# EAGLE design inwich (EAGLE 9.5.2)
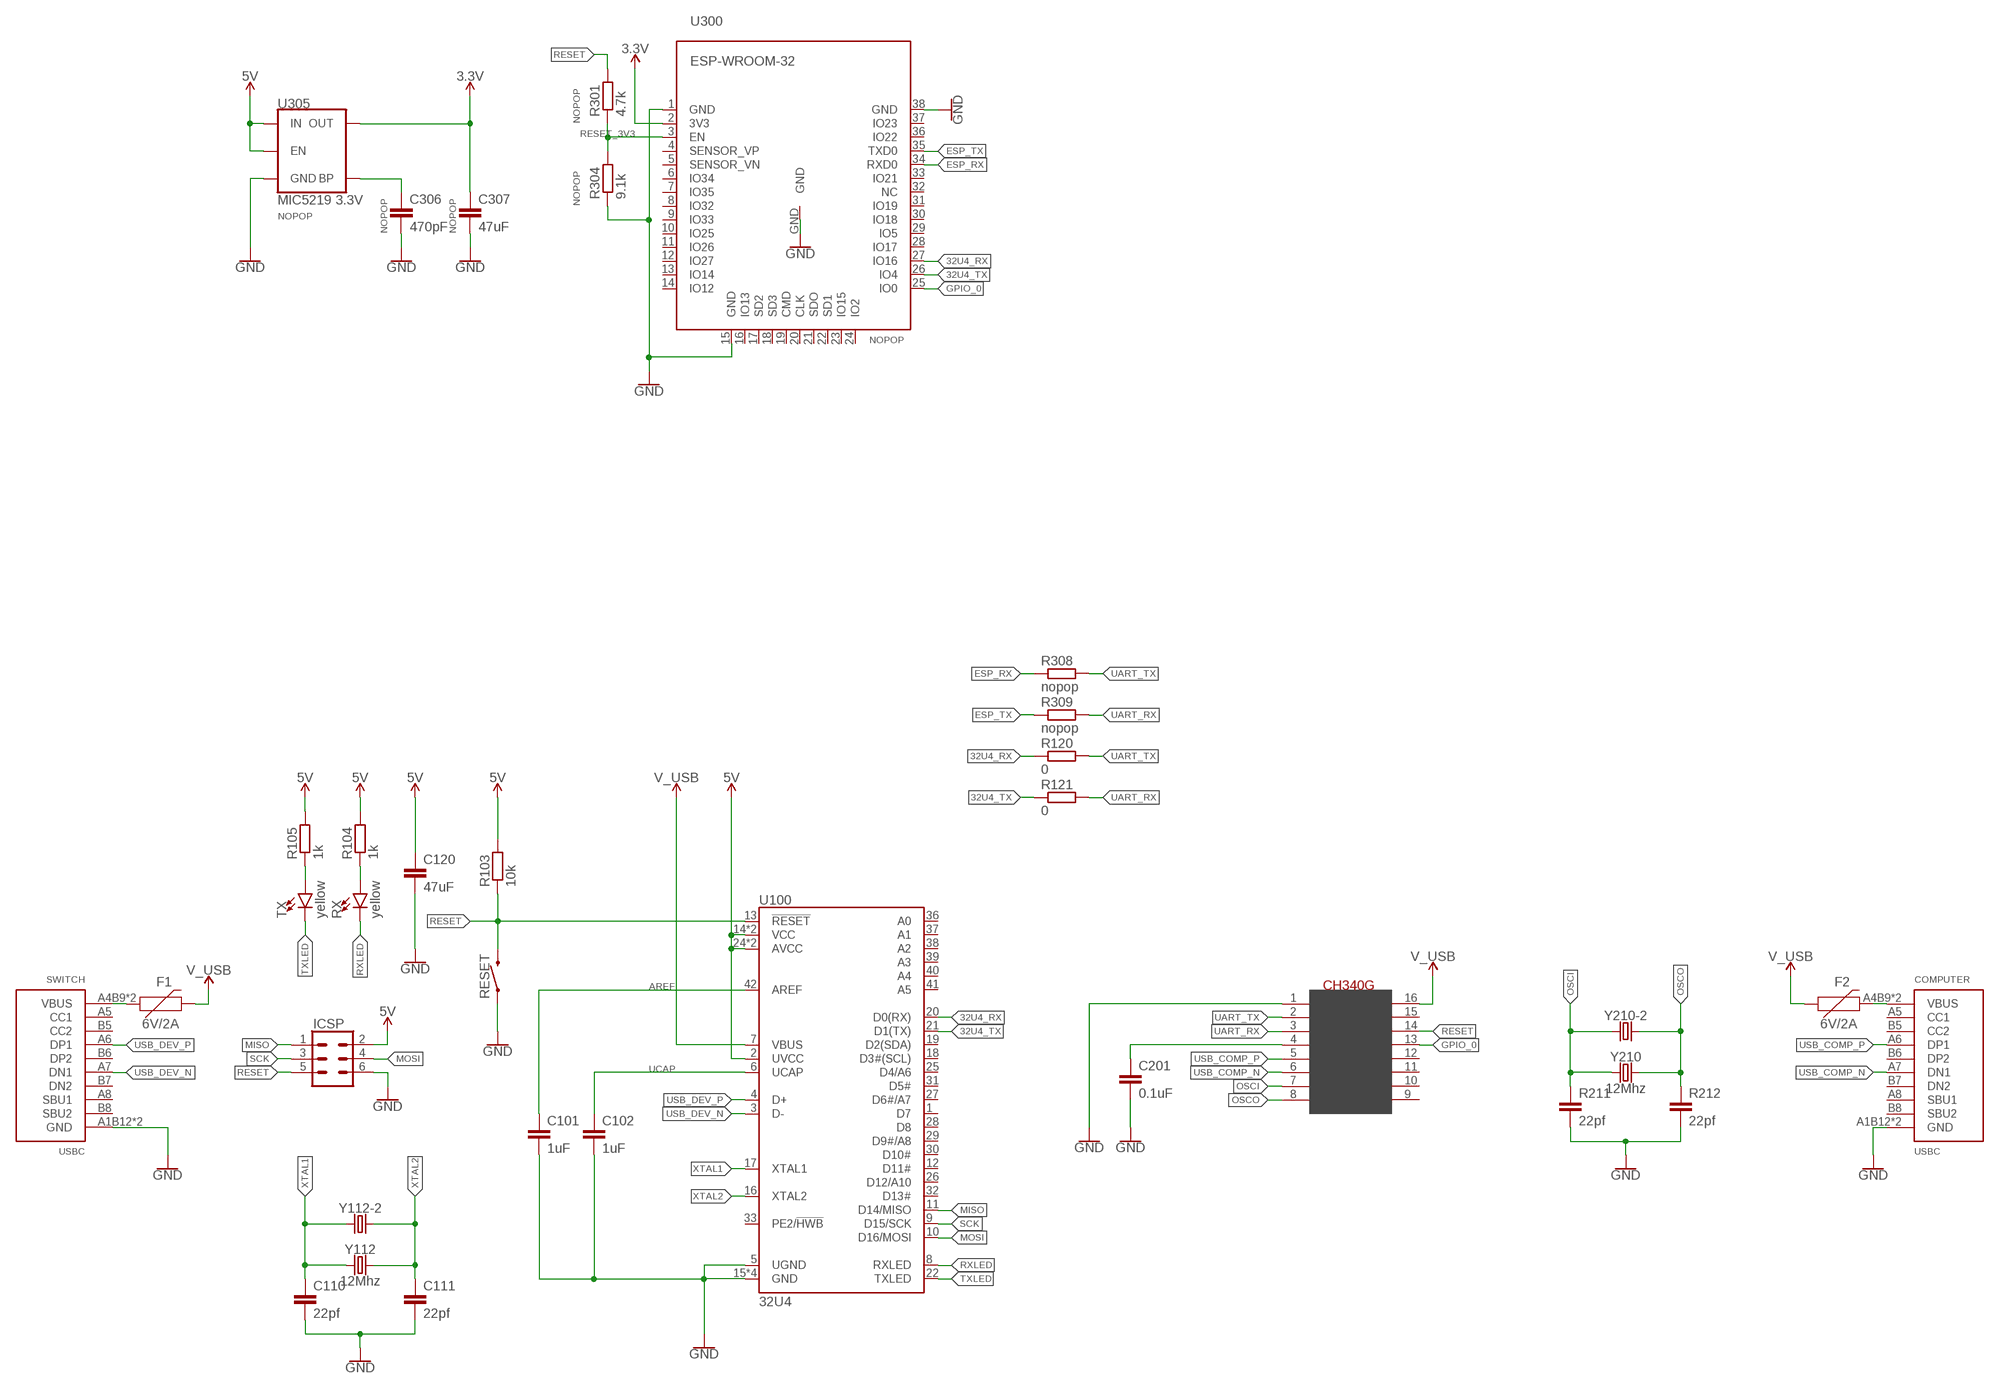
[diagram p0: schematic, sheet 1]

## Parts
C101  1uF  C-EUC0805  [C0805]
C102  1uF  C-EUC0805  [C0805]
C110  22pf  C-EUC0805  [C0805]
C111  22pf  C-EUC0805  [C0805]
C120  47uF  C-EUC0805  [C0805]
C201  0.1uF  C-EUC0805  [C0805]
C306  470pF  C-EUC0805  [C0805]
C307  47uF  C-EUC0805  [C0805]
COMPUTER  USBC  [USBC]
F1  6V/2A  PPTC_6V2A  [1210]
F2  6V/2A  PPTC_6V2A  [1210]
ICSP  CONN_03X2SHROUD  [2X3-SHROUDED]
R103  10k  R-EU_R0805  [R0805]
R104  1k  R-EU_R0805  [R0805]
R105  1k  R-EU_R0805  [R0805]
R120  0  R-EU_R0805  [R0805]
R121  0  R-EU_R0805  [R0805]
R211  22pf  C-EUC0805  [C0805]
R212  22pf  C-EUC0805  [C0805]
R301  4.7k  R-EU_R0805  [R0805]
R304  9.1k  R-EU_R0805  [R0805]
R308  nopop  R-EU_R0805  [R0805]
R309  nopop  R-EU_R0805  [R0805]
RESET  MOMENTARY-SWITCH-SPST-SMD-6.0X3.5MM  [TACTILE_SWITCH_SMD_6.0X3.5MM]
RX  yellow  LED1206  [LED-1206]
SWITCH  USBC  [USBC]
TX  yellow  LED1206  [LED-1206]
U100  32U4  ATMEGA32U4-ARDUINOTQFP-44  [TQFP44]
U200  CH340G  [SOIC16]
U300  ESP-WROOM-32  [ESP-WROOM-32]
U305  MIC5219 3.3V  V_REG_MIC52193.3V  [SOT23-5]
Y112  12Mhz  CRYSTALSMD-HC49UP  [HC49UP]
Y112-2  CRYSTALPTH-HC49UV  [HC49U]
Y210  12Mhz  CRYSTALSMD-HC49UP  [HC49UP]
Y210-2  CRYSTALPTH-HC49UV  [HC49U]

## Nets
3.3V: C307.1 U300.2(3V3) U305.5(OUT)
5V: C120.1 ICSP.2 R103.2 R104.2 R105.2 U100.2(UVCC) U100.14(VCC) U100.24(AVCC) U100.34(VCC) U100.44(AVCC) U305.1(IN) U305.3(EN)
32U4_RX: R120.1 U100.20(D0(RX)) U300.27(IO16)
32U4_TX: R121.1 U100.21(D1(TX)) U300.26(IO4)
AREF: C101.1 U100.42(AREF)
ESP_RX: R308.1 U300.34(RXD0)
ESP_TX: R309.1 U300.35(TXD0)
GND: C101.2 C102.2 C110.2 C111.2 C120.2 C201.2 C306.2 C307.2 COMPUTER.A1B12(GND) COMPUTER.B1A12(GND) ICSP.6 R211.2 R212.2 R304.1 RESET.1 SWITCH.A1B12(GND) SWITCH.B1A12(GND) U100.5(UGND) U100.15(GND) U100.23(GND) U100.35(GND) U100.43(GND) U200.1(GND) U300.1(GND) U300.15(GND) U300.38(GND) U300.GND U305.2(GND)
GPIO_0: U200.13(DTR) U300.25(IO0)
MISO: ICSP.1 U100.11(D14/MISO)
MOSI: ICSP.4 U100.10(D16/MOSI)
N$1: R105.1 TX.A
N$3: R104.1 RX.A
N$8: C201.1 U200.4(V3)
N$12: C306.1 U305.4(BP)
OSCI: R211.1 U200.7(XI) Y210-2.1 Y210.1
OSCO: R212.1 U200.8(XO) Y210-2.2 Y210.2
RESET: ICSP.5 R103.1 R301.2 RESET.2 U100.13(!RESET) U200.14(RTS)
RESET_3V3: R301.1 R304.2 U300.3(EN)
RXLED: RX.C U100.8(RXLED)
SCK: ICSP.3 U100.9(D15/SCK)
TXLED: TX.C U100.22(TXLED)
UART_RX: R121.2 R309.2 U200.3(RX)
UART_TX: R120.2 R308.2 U200.2(TX)
UCAP: C102.1 U100.6(UCAP)
USB_COMP_N: COMPUTER.A7(DN1) U200.6(D-)
USB_COMP_P: COMPUTER.A6(DP1) U200.5(D+)
USB_DEV_N: SWITCH.A7(DN1) U100.3(D-)
USB_DEV_P: SWITCH.A6(DP1) U100.4(D+)
V_USB: F1.2 F2.1 U100.7(VBUS) U200.16(VCC)
V_USB_DEV: F1.1 SWITCH.A4B9(VBUS) SWITCH.B4A9(VBUS)
VUSB_COMP: COMPUTER.A4B9(VBUS) COMPUTER.B4A9(VBUS) F2.2
XTAL1: C110.1 U100.17(XTAL1) Y112-2.1 Y112.1
XTAL2: C111.1 U100.16(XTAL2) Y112-2.2 Y112.2
Unconnected: COMPUTER.A5(CC1) COMPUTER.A8(SBU1) COMPUTER.B5(CC2) COMPUTER.B6(DP2) COMPUTER.B7(DN2) COMPUTER.B8(SBU2) SWITCH.A5(CC1) SWITCH.A8(SBU1) SWITCH.B5(CC2) SWITCH.B6(DP2) SWITCH.B7(DN2) SWITCH.B8(SBU2) U100.1(D7) U100.12(D11#) U100.18(D3#(SCL)) U100.19(D2(SDA)) U100.25(D4/A6) U100.26(D12/A10) U100.27(D6#/A7) U100.28(D8) U100.29(D9#/A8) U100.30(D10#) U100.31(D5#) U100.32(D13#) U100.33(PE2/!HWB) U100.36(A0) U100.37(A1) U100.38(A2) U100.39(A3) U100.40(A4) U100.41(A5) U200.9(CTS) U200.10(DSR) U200.11(RI) U200.12(DCD) U200.15(RS232) U300.4(SENSOR_VP) U300.5(SENSOR_VN) U300.6(IO34) U300.7(IO35) U300.8(IO32) U300.9(IO33) U300.10(IO25) U300.11(IO26) U300.12(IO27) U300.13(IO14) U300.14(IO12) U300.16(IO13) U300.17(SD2) U300.18(SD3) U300.19(CMD) U300.20(CLK) U300.21(SDO) U300.22(SD1) U300.23(IO15) U300.24(IO2) U300.28(IO17) U300.29(IO5) U300.30(IO18) U300.31(IO19) U300.32(NC) U300.33(IO21) U300.36(IO22) U300.37(IO23)

## Notes on the sheet
- NOPOP
- NOPOP
- NOPOP
- NOPOP | NOPOP
- NOPOP

## Library data of the parts
C101 C102 C110 C111 C120 C201 C306 C307 R211 R212 = rcl:C-EU: CAPACITOR, European symbol; SPICEPREFIX: C
COMPUTER SWITCH = geusebio:USBC
F1 F2 = SparkFun-Fuses:PPTC: Resettable Fuse PPTC Resettable Fuse. Really a sort of resistor with a polymeric positive temperature coefficient whose resistance increases dramatically with an increase in temperature. When heated by the power passing through the resistance rises causing the current to be limited, protecting the circuit. This is achieved by the transition of the polymer from a crystalline to an amorphous state where the conductive carbon separates breaking the conductive pathways found in the cool crystalline structure. When a PPTC cools back down it resumes conducting letting the circuit turn back on. SparkFun Products: SparkFun RedBoard - Programmed with Arduino <https://www.sparkfun.com/products/12757> Pro Micro - 5V/16MHz <https://www.sparkfun.com/products/12640> Arduino Pro 328 - 5V/16MHz <https://www.sparkfun.com/products/10915> MP3 Trigger <https://www.sparkfun.com/products/13720>; PROD_ID: RES-14313
ICSP = SparkFun-Connectors:CONN_03X2: Multi connection point. Often used as Generic Header-pin footprint for 0.1 inch spaced/style header connections You can populate with any combo of single row headers, but if you'd like an exact match, check these: Header - 2x3 (Male, 0.1") <https://www.sparkfun.com/products/12807> (PRT-12807) Header - 2x3 (Female, 0.1") <https://www.sparkfun.com/products/13010> (PRT-13010) 2x3 Pin Shrouded Header <https://www.sparkfun.com/products/10877> (PRT-10877) On any of the 0.1 inch spaced packages, you can populate with these: Break Away Headers - Straight <https://www.sparkfun.com/products/116> (PRT-00116) Break Away Male Headers - Right Angle <https://www.sparkfun.com/products/553> (PRT-00553) Female Headers <https://www.sparkfun.com/products/115> (PRT-00115) Break Away Headers - Machine Pin <https://www.sparkfun.com/products/117> (PRT-00117) Break Away Female Headers - Swiss Machine Pin <https://www.sparkfun.com/products/743> (PRT-00743) Special note: the shrouded connector mates well with our 3x2 ribbon cables: Ribbon Crimp Connector - 6-pin (2x3, Female) <https://www.sparkfun.com/products/10651> (PRT-10651) Ribbon Cable - 6 wire (15ft) <https://www.sparkfun.com/products/10646> (PRT-10646); PROD_ID: CONN-10681; SF_ID: PRT_10877
R103-R105 R120 R121 R301 R304 R308 R309 = rcl:R-EU_: RESISTOR, European symbol; SPICEPREFIX: R
RESET = SparkFun-Switches:MOMENTARY-SWITCH-SPST: Momentary Switch (Pushbutton) - SPST Normally-open (NO) SPST momentary switches (buttons, pushbuttons). Variants PTH-12MM - 12mm square, through-hole Momentary Pushbutton Switch - 12mm Square <https://www.sparkfun.com/products/9190> (COM-09190) PTH-6.0MM, PTH-6.0MM-KIT - 6.0mm square, through-hole Mini Pushbutton Switch <https://www.sparkfun.com/products/97> (COM-00097) KIT package intended for soldering kit's - only one side of pads' copper is exposed. PTH-RIGHT-ANGLE-KIT - Right-angle, through-hole Right Angle Tactile Button <https://www.sparkfun.com/products/10791> - Used on SparkFun BigTime Watch Kit <https://www.sparkfun.com/products/11734> SMD-12MM - 12mm square, surface-mount Tactile Button - SMD (12mm) <https://www.sparkfun.com/products/12993> (COM-12993) Used on SparkFun PicoBoard <https://www.sparkfun.com/products/11888> SMD-4.5MM - 4.5mm Square Trackball Switch Used on SparkFun Blackberry Trackballer Breakout <https://www.sparkfun.com/products/13169> SMD-4.6MMX2.8MM - 4.60mm x 2.80mm, surface mount Used on SparkFun SAMD21 Mini Breakout <https://www.sparkfun.com/products/13664> SMD-5.2MM, SMD-5.2-REDUNDANT - 5.2mm square, surface-mount Mini Pushbutton Switch - SMD <https://www.sparkfun.com/products/8720> (COM-08720) Used on Arduino Pro Mini <https://www.sparkfun.com/products/11114> REDUNDANT package connects both switch circuits together SMD-6.0X3.5MM - 6.0 x 3.5mm, surface mount Momentary Reset Switch SMD <https://www.sparkfun.com/products/8229> (COM-08229) SMD-6.2MM-TALL - 6.2mm square, surface mount Tactile Button - SMD (6mm) <https://www.sparkfun.com/products/12992> Used on SparkFun Digital Sandbox <https://www.sparkfun.com/products/12651> SMD-RIGHT-ANGLE - Right-angle, surface mount Used on SparkFun Block for Intel® Edison - Arduino <https://www.sparkfun.com/products/13036>; PROD_ID: SWCH-00815; SF_SKU: COM-08229
RX TX = SparkFun-LED:LED: LED (Generic) Standard schematic elements and footprints for 5mm, 3mm, 1206, and 0603 sized LEDs. Generic LEDs with no color specified.
U100 = SparkFun-IC-Microcontroller:ATMEGA32U4-ARDUINO: Atmel MCU, 32KByte Atmel 44-pin 8-bit Microcontroller with 32KBytes of ISP Flash and USB Controller Datasheet <http://cdn.sparkfun.com/datasheets/Dev/Arduino/Boards/ATMega32U4.pdf> SparkFun Products LilyPad Arduino USB - ATmega32U4 Board <https://www.sparkfun.com/products/12049> (DEV-12049) Pro Micro - 5V/16MHz <https://www.sparkfun.com/products/12640> (DEV-12640) Pro Micro - 3.3V/8MHz <https://www.sparkfun.com/products/12587> (DEV-12587) Fio v3 - ATmega32U4 <https://www.sparkfun.com/products/11520> (DEV-11520) Qduino Mini <https://www.sparkfun.com/products/13614> (DEV-13614) Makey Makey - Standard Kit <https://www.sparkfun.com/products/11511> (WIG-11511) Makey Makey Deluxe Kit <https://www.sparkfun.com/products/11519> (WIG-11519); PROD_ID: IC-11161
U200 = CH340G-USB-SERIAL:CH340G
U300 = esp32:ESP-WROOM-32
U305 = SparkFun-IC-Power:V_REG_MIC5219: V_REG MIC5219 Standard 3.3V and 5V 500mA LDO voltage regulator in SOT-23 layout. Micrel part MIC5219. BP (by-pass) pin is used to lower output noise with 470pF cap, may be left open.; PROD_ID: VREG-09872
Y112 Y112-2 Y210 Y210-2 = SparkFun-Clocks:CRYSTAL: Crystals (Generic) These are passive quartz crystals, which can be used as a clock source for a microcontroller. Crystal's are two-terminal devices. They require external "load" capacitors to generate an oscillating signal.

## Board
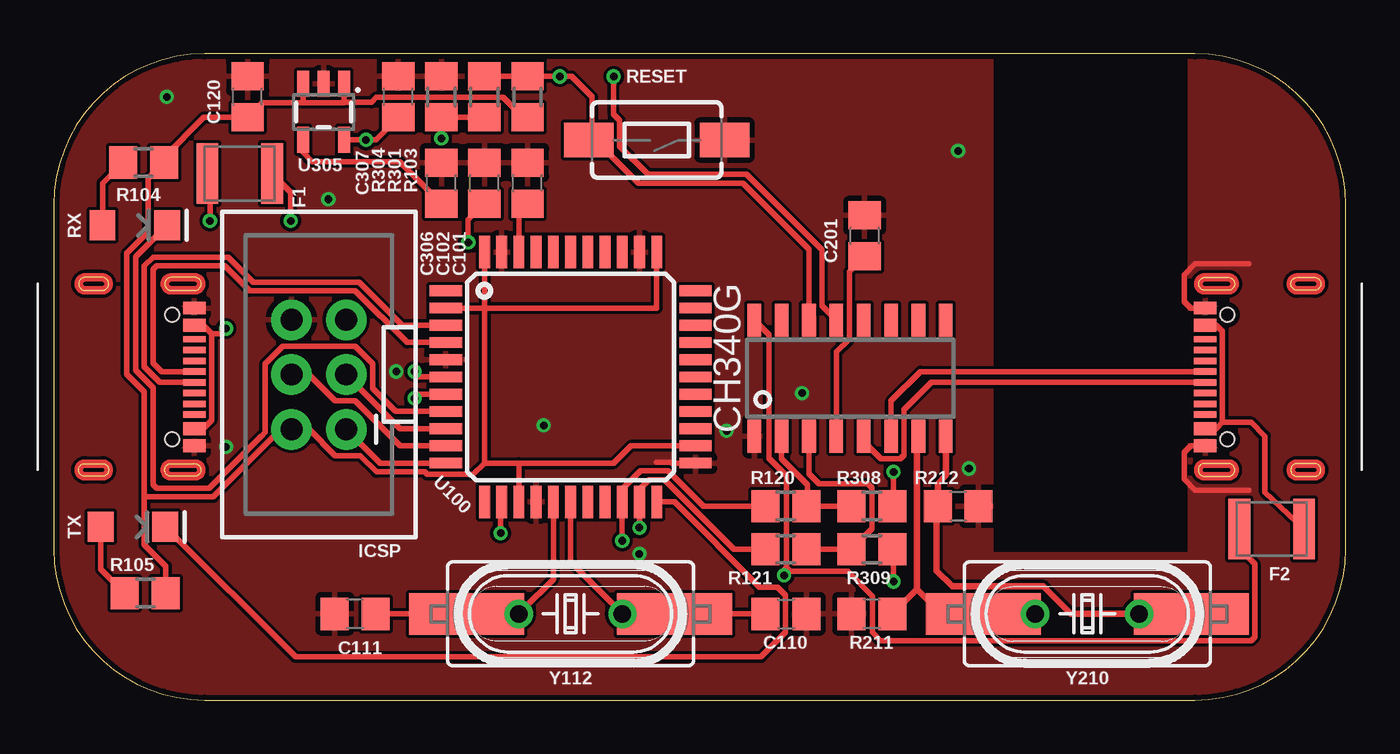
[diagram p1: board, top side]
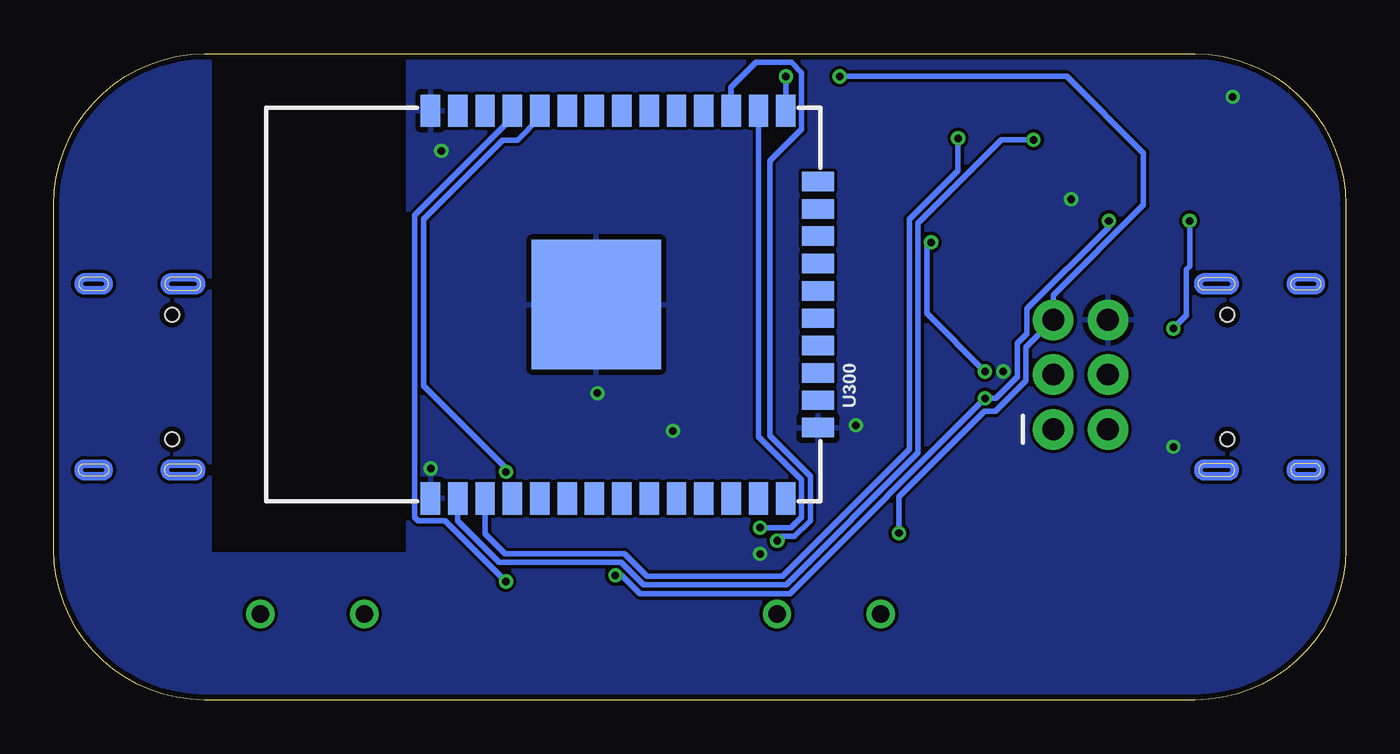
[diagram p2: board, bottom side, seen from below]

Size 60 x 30 mm. Coordinates in mm from the lower left corner, seen from the top.
Outline: 0,23 0,7 arc90 7,0 53,0 arc90 60,7 60,23 arc90 53,30 7,30 arc90 0,23
Copper layers (1*16): Top 0.035mm / dielectric 1.5mm / Bottom 0.035mm
Design rules "dirtypcbs": minimum track width 6mil, minimum drill 12mil, track to track 6mil, track to pad 6mil, pad to pad 6mil, via to via 6mil, smd to smd 0mil, copper to edge 10mil, drill to drill 10mil, minimum pad ring 10mil, minimum via ring 6mil, stop-mask expansion 2mil, vias tented up to drill 25mil, thermal gap 10mil

### Footprints (pad centres in the part's own frame; a part is rotated, then mirrored left to right if it is on the bottom)
C0805 = smd 1.3 x 1.5: 1 -0.95,0; 2 0.95,0
USBC = smd 0.6 x 1.05: A1B12 -3.2,0.525; A4B9 -2.4,0.525; B1A12 3.2,0.525; B4A9 2.4,0.525 | smd 0.3 x 1.05: A5 -1.25,0.525; A6 -0.25,0.525; A7 0.25,0.525; A8 -1.75,0.525; B5 1.75,0.525; B6 0.75,0.525; B7 -0.75,0.525; B8 1.25,0.525 | hole 0.65: 2.89,-0.5; -2.89,-0.5
1210 = smd 1 x 2.8: 1 -1.5,0; 2 1.5,0
2X3-SHROUDED = drill 1.016 pad 1.88: 1 -1.27,2.54; 2 1.27,2.54; 3 -1.27,0; 4 1.27,0; 5 -1.27,-2.54; 6 1.27,-2.54
R0805 = smd 1.3 x 1.5: 1 -0.95,0; 2 0.95,0
TACTILE_SWITCH_SMD_6.0X3.5MM = smd 2.3 x 1.6: 1 -3.15,0; 2 3.15,0
LED-1206 = smd 1.2 x 1.4: A -1.5,0; C 1.5,0
TQFP44 = smd 1.5 x 0.5: 1 -5.8,4; 2 -5.8,3.2; 3 -5.8,2.4; 4 -5.8,1.6; 5 -5.8,0.8; 6 -5.8,0; 7 -5.8,-0.8; 8 -5.8,-1.6; 9 -5.8,-2.4; 10 -5.8,-3.2; 11 -5.8,-4; 23 5.8,-4; 24 5.8,-3.2; 25 5.8,-2.4; 26 5.8,-1.6; 27 5.8,-0.8; 28 5.8,0; 29 5.8,0.8; 30 5.8,1.6; 31 5.8,2.4; 32 5.8,3.2; 33 5.8,4 | smd 0.5 x 1.5: 12 -4,-5.8; 13 -3.2,-5.8; 14 -2.4,-5.8; 15 -1.6,-5.8; 16 -0.8,-5.8; 17 0,-5.8; 18 0.8,-5.8; 19 1.6,-5.8; 20 2.4,-5.8; 21 3.2,-5.8; 22 4,-5.8; 34 4,5.8; 35 3.2,5.8; 36 2.4,5.8; 37 1.6,5.8; 38 0.8,5.8; 39 0,5.8; 40 -0.8,5.8; 41 -1.6,5.8; 42 -2.4,5.8; 43 -3.2,5.8; 44 -4,5.8
SOIC16 = smd 0.635 x 1.524: 1 -4.445,-2.695; 2 -3.175,-2.695; 3 -1.905,-2.695; 4 -0.635,-2.695; 5 0.635,-2.695; 6 1.905,-2.695; 7 3.175,-2.695; 8 4.445,-2.695; 9 4.445,2.695; 10 3.175,2.695; 11 1.905,2.695; 12 0.635,2.695; 13 -0.635,2.695; 14 -1.905,2.695; 15 -3.175,2.695; 16 -4.445,2.695
ESP-WROOM-32 = smd 0.9 x 1.5: 1 7.7,9; 2 6.43,9; 3 5.16,9; 4 3.89,9; 5 2.62,9; 6 1.35,9; 7 0.08,9; 8 -1.19,9; 9 -2.46,9; 10 -3.73,9; 11 -5,9; 12 -6.27,9; 13 -7.54,9; 14 -8.81,9; 25 -8.81,-9; 26 -7.54,-9; 27 -6.27,-9; 28 -5,-9; 29 -3.73,-9; 30 -2.46,-9; 31 -1.19,-9; 32 0.08,-9; 33 1.35,-9; 34 2.62,-9; 35 3.89,-9; 36 5.16,-9; 37 6.43,-9; 38 7.7,-9 | smd 1.5 x 0.9: 15 -10.3,5.715; 16 -10.3,4.445; 17 -10.3,3.175; 18 -10.3,1.905; 19 -10.3,0.635; 20 -10.3,-0.635; 21 -10.3,-1.905; 22 -10.3,-3.175; 23 -10.3,-4.445; 24 -10.3,-5.715 | smd 6 x 6: GND 0,0
SOT23-5 = smd 0.55 x 1.2: 1 -0.95,-1.3; 2 0,-1.3; 3 0.95,-1.3; 4 0.95,1.3; 5 -0.95,1.3
HC49UP = smd 5.334 x 1.93: 1 -4.826,0; 2 4.826,0
HC49U = drill 0.813: 1 -2.413,0; 2 2.413,0

### Placement (x,y rotation side)
C101  22,24 90 top
C102  20,24 90 top
C110  34,4 0 top
C111  14,4 180 top
C120  9,28 90 top
C201  37.66,21.55 90 top
C306  18,24 90 top
C307  16,28 90 top
COMPUTER  54,15 90 top
F1  8.64,24.44 0 top
F2  56.56,7.94 0 top
ICSP  12.31,15.11 180 top
R103  22,28 270 top
R104  4.17,24.96 0 top
R105  4.25,4.96 0 top
R120  34,9 0 top
R121  34,7 0 top
R211  38,4 180 top
R212  42,9 0 top
R301  20,28 90 top
R304  18,28 270 top
R308  38,9 180 top
R309  38,7 180 top
RESET  28,26 180 top
RX  3.76,22.04 0 top
SWITCH  6,15 270 top
TX  3.68,8.04 0 top
U100  24,15 0 top
U200  36.98,14.94 0 top
U300  34.81,18.36 180 bottom
U305  12.53,27.31 180 top
Y112  24,4 180 top
Y112-2  24,4 180 top
Y210  48,4 0 top
Y210-2  48,4 0 top

### Tracks (layer width: path | path; a pad name or v marks a point on that pad's centre or on a via)
3.3V  (via drill 0.35)
  Top 0.254: C307.1 14.96,26.01 U305.5 v14.5,26.01
  Bottom 0.254: U300.2 41.24,8.31 39.32,6.39 33.66,6.39 32.62,5.35 25.98,5.35 19.86,11.47 19.86,22.14 15.99,26.01 v14.5,26.01
5V
  Top 0.254: 13.48,27.75 13.48,27.73 11.58,27.73 | 13.48,27.75 U305.1 | 11.58,27.73 9.68,27.73 C120.1 6.96,27.05 5.12,25.21 R104.2 4.38,24.22 4.38,21.73 3.39,20.75 3.39,15.13 4.2,14.32 4.2,9.43 | 20,11 19.47,10.47 17.33,10.47 17.21,10.59 14.98,10.59 14.22,11.35 13.07,11.35 11.86,12.57 ICSP.2 10.54,12.57 7.4,9.43 4.2,9.43 | 20,11 21.6,11 | 21.6,11 26,11 26.8,11.8 U100.24 | U100.14 21.6,11 | U100.44 20,18.2 | 20,18.2 20,11 | U100.2 20,18.2 | U100.34 28,18.2 20,18.2 | R103.2 21.8,27.05 20.87,27.98 14.98,27.98 14.75,27.75 13.48,27.75 | 4.2,9.43 4.2,7.21 5.2,6.21 R105.2 | U305.3 11.58,27.73
32U4_RX  (via drill 0.35)
  Top 0.254: R120.1 30.17,9 28.53,10.64 27.24,10.64 26.4,9.79 U100.20 v26.4,7.39
  Bottom 0.254: v26.4,7.39 26.2,7.59 25.6,7.59 24.86,8.33 24.86,10.39 26.73,12.27 26.73,25.03 25.27,26.49 25.27,29.13 25.75,29.61 27.39,29.61 28.54,28.46 U300.27
32U4_TX  (via drill 0.35)
  Top 0.254: R121.1 31.59,7 28.37,10.23 27.63,10.23 27.2,9.79 U100.21 v27.2,8
  Bottom 0.254: U300.26 27.27,12.22 25.27,10.23 25.27,8.49 25.77,8 v27.2,8
AREF
  Top 0.254: U100.42 21.6,22.65 C101.1
ESP_RX  (via drill 0.35)
  Top 0.254: v39,10.59 39,9.05 R308.1
  Bottom 0.254: U300.34 37.43,27.04 38.47,26 39.16,26 42.83,22.33 42.83,14.58 39,10.75 v39,10.59
ESP_TX  (via drill 0.35)
  Top 0.254: R309.1 39,6.95 v39,5.5
  Bottom 0.254: v39,5.5 41.83,8.33 43.08,8.33 43.24,8.49 43.24,22.5 39.24,26.49 39.24,26.51 38.7,27.05 U300.35
GND  (via drill 0.35)
  Top 0.254: U100.23 28.75,11 28.7,11.04 28,11.04 | COMPUTER.A1B12 52.8,11.8 52.5,11.5 52.5,10.25 53,9.75 55.5,9.75 | COMPUTER.B1A12 52.8,18.2 52.5,18.5 52.5,19.75 53,20.25 55.5,20.25
  other vias: 12.75,23.25 27.2,6.79 15.9,15.25 34.75,14.25 42,25.5 5.25,28 8,11.75 22.75,12.75 31.25,12.5 42.5,10.75
  pour Top: 0,30 60,30 60,0 0,0
  pour Bottom: 0,30 60,30 60,0 0,0
GPIO_0  (via drill 0.35)
  Top 0.254: U200.13 35.67,18.31 35.67,20.9 32.17,24.41 27.59,24.41 26.28,25.72 26.28,26.92 26,27.2 v26,28.95
  Bottom 0.254: v26,28.95 U300.25
MISO
  Top 0.254: U100.11 15.15,11 ICSP.1
MOSI
  Top 0.254: U100.10 16.07,11.8 13.98,13.89 13.07,13.89 11.86,15.11 ICSP.4
N$1
  Top 0.254: TX.A 2.18,6.08 R105.1
N$3
  Top 0.254: RX.A 2.26,24 R104.1
N$8
  Top 0.254: U200.4 36.34,16.16 36.94,16.76 36.94,19.88 C201.1
N$12
  Top 0.254: C306.1 16.05,25 12,25 11.58,25.42 U305.4
OSCI
  Top 0.305: U200.7 40.16,12 40.09,11.94 40.09,5.14 | R211.1 40.09,5.14 | 40.09,5.14 41.24,4 Y210.1 Y210-2.1
OSCO
  Top 0.305: Y210-2.2 Y210.2 47.24,4 45.97,5.27 41.73,5.27 41,6 41,8.95 R212.1 41.05,10.05 41.42,10.43 U200.8
RESET  (via drill 0.35)
  Top 0.254: R301.2 R103.1 v23.5,28.95 24.05,28.95 25,28 25,26.15 | 25,26.15 RESET.2 | U200.14 35.08,20.93 32,24 27.15,24 25,26.15 | v20.75,7.75 20.75,9.15 U100.13
  Bottom 0.254: v20.75,7.75 20.75,9.43 16.77,13.4 16.27,13.4 14.84,14.83 14.84,16.39 ICSP.5 13.58,18.8 9.39,22.99 9.39,25.39 12.95,28.95 v23.5,28.95
RESET_3V3  (via drill 0.35)
  Top 0.254: R301.1 R304.2 v18,26.08
  Bottom 0.254: U300.3 39.97,7.72 39.05,6.8 33.5,6.8 32.45,5.75 26.15,5.75 20.26,11.64 20.26,22.31 18,24.57 v18,26.08
RXLED
  Top 0.254: RX.C 3.8,20.58 3.8,15.3 4.61,14.49 4.61,10 4.77,9.84 7.23,9.84 9.63,12.25 9.64,12.25 9.82,12.43 9.82,15.62 10.64,16.43 13.98,16.43 14.8,15.62 14.8,14.47 15.87,13.4 U100.8
SCK
  Top 0.254: U100.9 16.09,12.6 ICSP.3
TXLED
  Top 0.254: TX.C 11.22,2 32.84,2 33.98,3.13 33.98,4.87 33.6,5.25 32.78,5.25 28.82,9.2 U100.22
UART_RX
  Top 0.254: R121.2 R309.2 38,7.95 38,9.85 37.82,10.03 35.55,10.03 35.08,10.5 U200.3
UART_TX
  Top 0.254: R120.2 35,9 | 35,9 R308.2 | U200.2 33.8,11.2 35,10 35,9
UCAP  (via drill 0.35)
  Top 0.254: v16.75,15.25 16.75,15.2 16.95,15 U100.6 | v19.25,21.25 19.25,22.3 C102.1
  Bottom 0.254: v19.25,21.25 19.45,21.05 19.45,17.95 v16.75,15.25
USB_COMP_N
  Top 0.254: U200.6 38.88,13.88 40.25,15.25 COMPUTER.A7
USB_COMP_P
  Top 0.254: COMPUTER.A6 40.75,14.75 39.48,13.48 39.48,11.37 39.32,11.2 38.41,11.2 37.62,12 U200.5
USB_DEV_N
  Top 0.254: U100.3 16.18,17.4 14.17,19.41 9.26,19.41 8.1,20.57 4.61,20.57 4.2,20.16 4.2,15.47 4.92,14.75 SWITCH.A7
USB_DEV_P
  Top 0.254: U100.4 16.4,16.6 14,19 9.09,19 7.93,20.16 4.77,20.16 4.61,20 4.61,15.64 5,15.25 SWITCH.A6
V_USB  (via drill 0.35)
  Top 0.254: U100.7 16.94,14.2 v16.75,14.01 | 34.02,6.13 34.18,5.97 36.88,5.97 38.02,4.83 38.02,3.13 38.4,2.75 55.61,2.75 55.77,2.92 55.77,6.33 55.06,7.04 F2.1 | U200.16 33.21,16.96 33.21,11.22 34.02,10.4 34.02,6.13 | 34.02,6.13 33.92,6.03 v33.92,5.79 | F1.2 11,23.58 v11,22.25
  Bottom 0.254: v33.92,5.79 33.63,5.79 32.78,4.94 25.81,4.94 v16.75,14 v16.75,14.01 16.24,14.01 15.25,15 15.25,16.55 14.8,17.01 14.8,18.16 11,21.95 v11,22.25
V_USB_DEV  (via drill 0.35)
  Top 0.254: SWITCH.A4B9 6.95,17.4 7.33,17.02 | SWITCH.B4A9 6.95,12.6 7.33,12.98 7.33,17.02 | F1.1 7.25,24.43 v7.25,22.25 | v8,17.25 7.77,17.02 7.33,17.02
  Bottom 0.254: v8,17.25 7.39,17.86 7.39,20 7.25,20.14 v7.25,22.25
VUSB_COMP
  Top 0.254: COMPUTER.B4A9 53.99,17.4 54.28,17.11 54.28,12.89 | COMPUTER.A4B9 53.99,12.6 54.28,12.89 | F2.2 56.25,9.65 56.25,12.25 55.61,12.89 54.28,12.89
XTAL1
  Top 0.254: U100.17 24,6.41 Y112-2.1 Y112.1 C110.1
XTAL2
  Top 0.254: U100.16 23.2,5.61 21.79,4.21 | 21.79,4.21 Y112-2.2 | C111.1 Y112.2 19.38,4.21 21.79,4.21